# EAGLE schematic amp-LNA-TQP3M9036 (EAGLE 9.2.2)
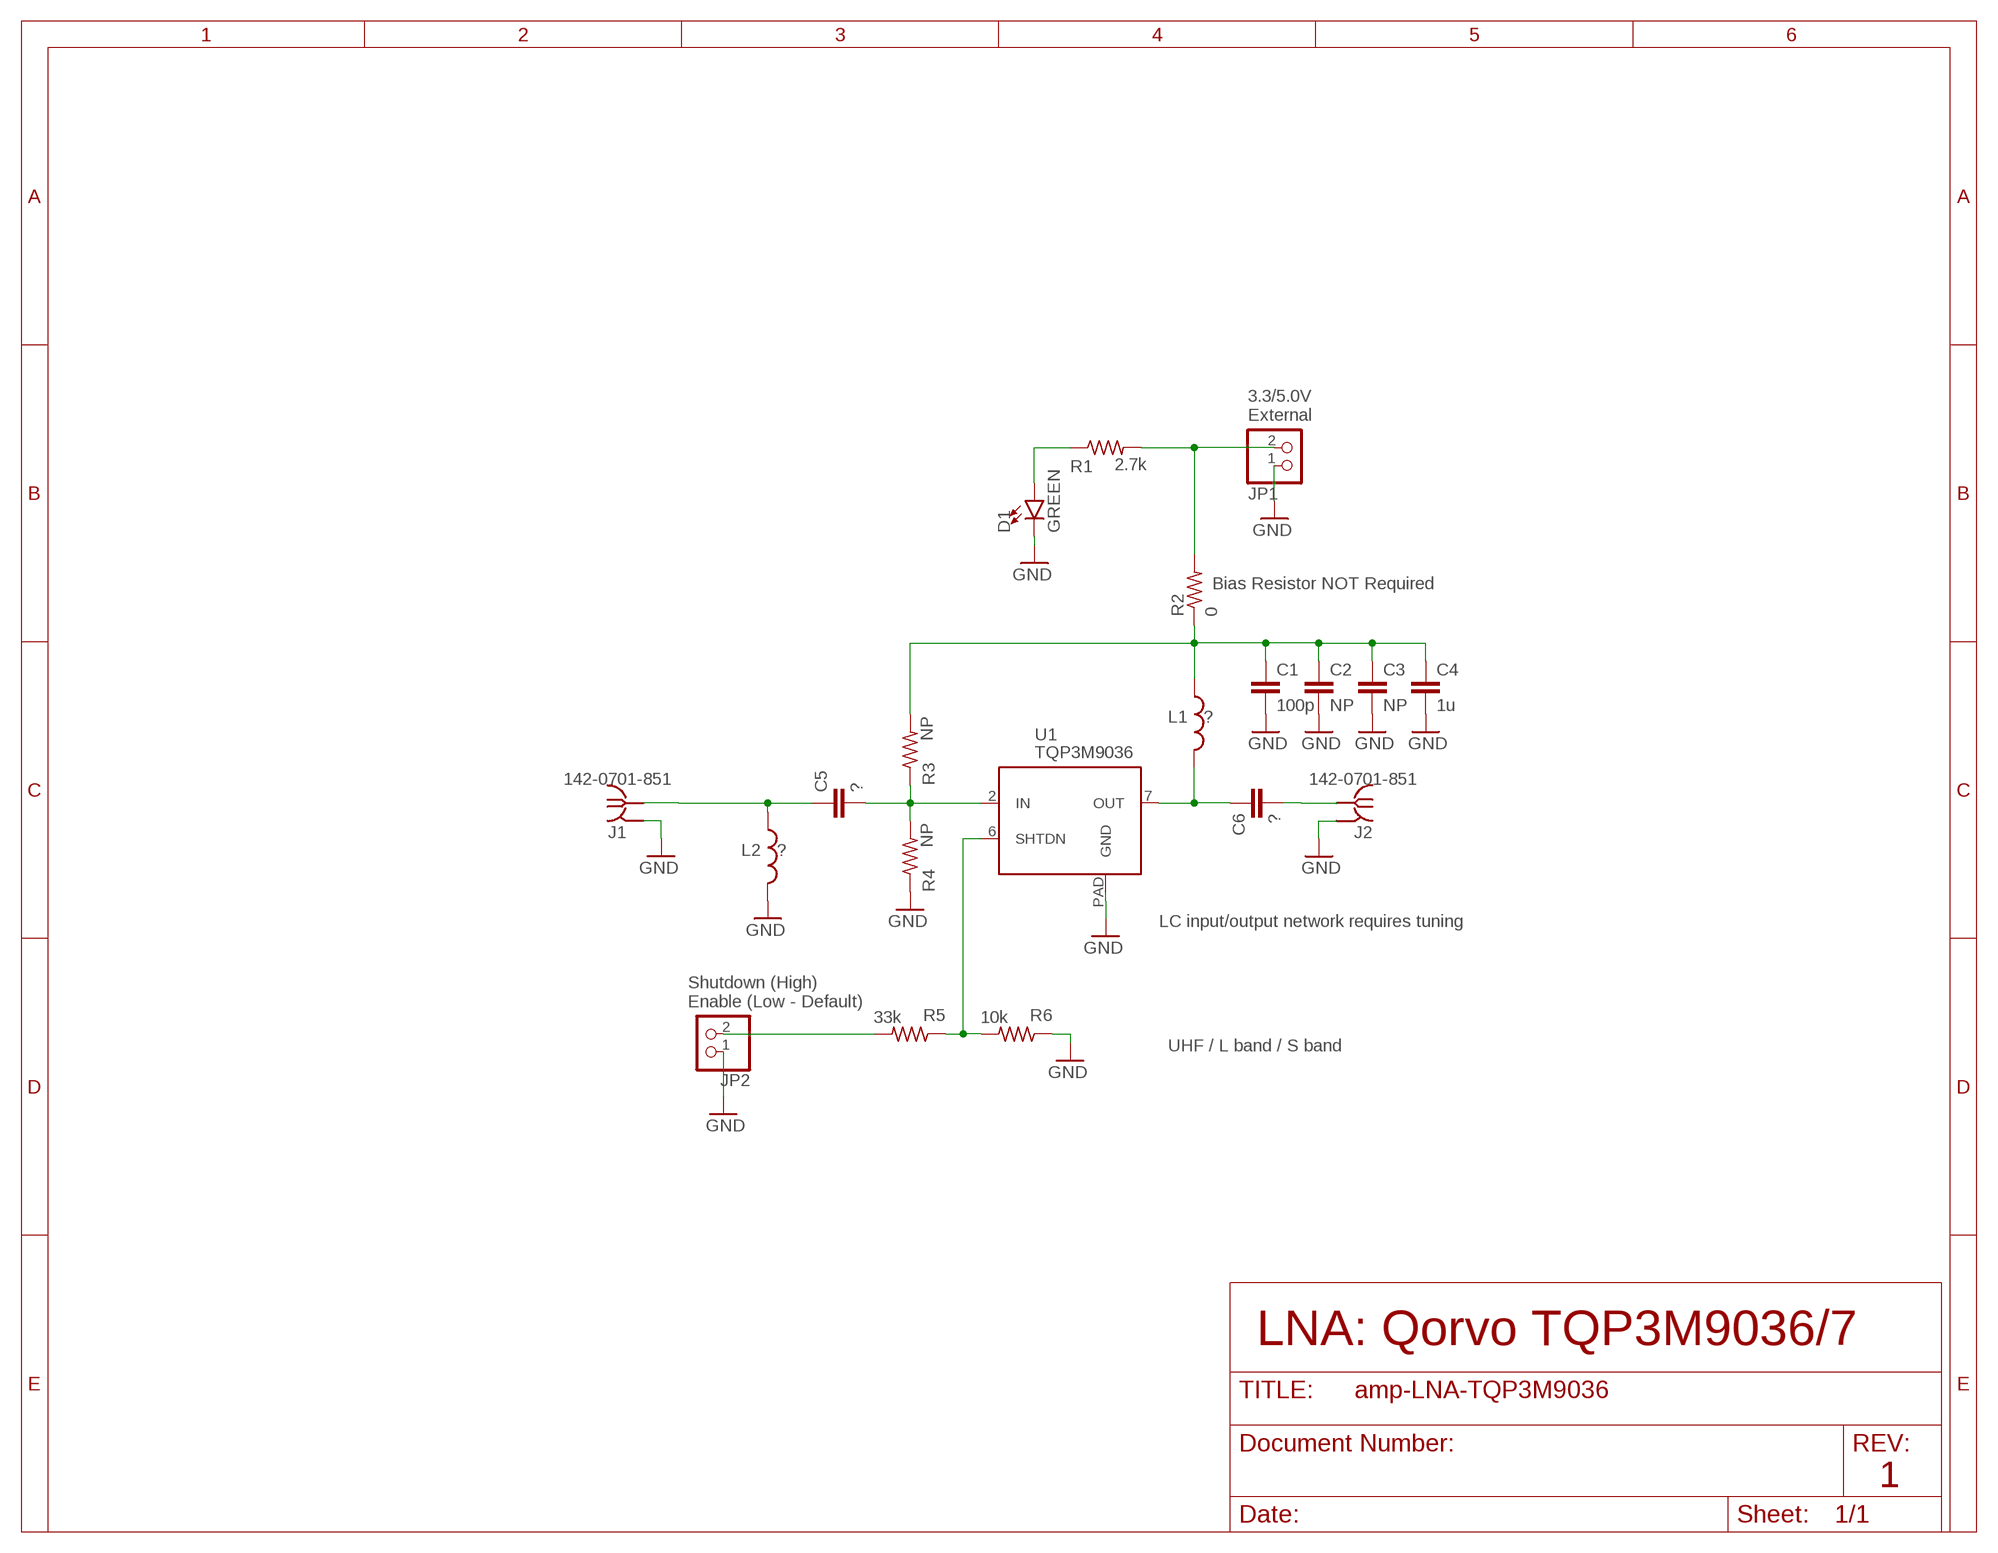
[diagram p0: schematic, sheet 1]

## Parts
C1  100p  C-EU0603-B-NOSILK  [.0603-B-NOSILK]
C2  NP  C-EU0603-B-NOSILK  [.0603-B-NOSILK]
C3  NP  C-EU0603-B-NOSILK  [.0603-B-NOSILK]
C4  1u  C-EU0603-B-NOSILK  [.0603-B-NOSILK]
C5  ?  C-EU0402-B-NOSILK  [.0402-B-NOSILK]
C6  ?  C-EU0402-B-NOSILK  [.0402-B-NOSILK]
D1  GREEN  LED-GREEN0603  [LED-0603]
J1  142-0701-851  [142-0701-851]
J2  142-0701-851  [142-0701-851]
JP1  PINHD-1X2  [1X02]
JP2  PINHD-1X2  [1X02]
L1  ?  L-US0603-B-NOSILK  [.0603-B-NOSILK]
L2  ?  L-US0402-B-NOSILK  [.0402-B-NOSILK]
R1  2.7k  R-US_0603-B-NOSILK  [.0603-B-NOSILK]
R2  0  R-US_0805-B-NOSILK  [.0805-B-NOSILK]
R3  NP  R-US_0402-B-NOSILK  [.0402-B-NOSILK]
R4  NP  R-US_0402-B-NOSILK  [.0402-B-NOSILK]
R5  33k  R-US_0603-B-NOSILK  [.0603-B-NOSILK]
R6  10k  R-US_0603-B-NOSILK  [.0603-B-NOSILK]
U1  TQP3M9036  [DFN8-2X2-WITH-PAD]

## Nets
GND: C1.2 C2.2 C3.2 C4.2 D1.C J1.GND1(GND) J1.GND2(GND) J1.GND3(GND) J1.GND4(GND) J2.GND1(GND) J2.GND2(GND) J2.GND3(GND) J2.GND4(GND) JP1.1 JP2.1 L2.2 R4.1 R6.1 U1.PAD(GND)
N$1: JP1.2 R1.2 R2.2
N$2: R5.1 R6.2 U1.6(SHTDN)
N$3: JP2.2 R5.2
N$21: D1.A R1.1
N$28: C6.1 L1.2 U1.7(OUT)
N$32: C5.2 R3.1 R4.2 U1.2(IN)
N$34: C6.2 J2.RF1(RF)
N$39: C5.1 J1.RF1(RF) L2.1
N$47: C1.1 C2.1 C3.1 C4.1 L1.1 R2.1 R3.2

## Notes on the sheet
- 3.3/5.0V
  External
- Bias Resistor NOT Required
- LC input/output network requires tuning
- Shutdown (High)
  Enable (Low - Default)
- UHF / L band / S band
- LNA: Qorvo TQP3M9036/7
- 1

## Library data of the parts
C1-C6 = oresat-rcl:C-EU: CAPACITOR, European symbol
D1 = SparkFun-LED:LED-GREEN: Green SMD LED Used in manufacturing of various products at SparkFun Packages: 0603 - SMD 0603 package [Product Link] <http://www.futureelectronics.com/en/technologies/semiconductors/optoelectronics/leds/Pages/9894312-LTST-C190GKT.aspx?CrossPart=HSMG-C190&IM=0> LilyPad 1206 - SMD1206 LilyPad package [Product Link] <http://www.futureelectronics.com/en/Technologies/Product.aspx?ProductID=IN150NGHARVATEKCORPORATION2049943&IM=0> 1206 - SMD1206 package [Product Link] <http://www.futureelectronics.com/en/technologies/semiconductors/optoelectronics/leds/Pages/8315665-LTST-C150KGKT.aspx?IM=0> 1206 Bottom Mount -SMD 1206 Bottom Mount [Product Link] <http://www.digikey.com/product-detail/en/lite-on-inc/LTST-C230KGKT/160-1456-1-ND/386854> SparkFun Products: Pro Mini 328 -5V <https://www.sparkfun.com/products/821> RedBoard <https://www.sparkfun.com/products/12757> MP3 Trigger <https://www.sparkfun.com/products/13720> Makey Makey <https://www.sparkfun.com/products/11076>
J1 J2 = J-Cinch-142-0701-851-SMA-end-launch:142-0701-851: SMA Jack 50Ω - End Launch Source: Datasheet <https://belfuse.com/resources/productinformations/cinchconnectivitysolutions/johnson/pi-ccs-john-142-0701-851.pdf>
JP1 JP2 = pinhead:PINHD-1X2: PIN HEADER
L1 L2 = oresat-rcl:L-US: INDUCTOR, American symbol
R1-R6 = oresat-rcl:R-US_: RESISTOR, American symbol
U1 = U-Qorvo-TQP3M9036-LNA:TQP3M9036: Ultra Low Noise, High Linearity LNA 0.1 - 2.0 GHz Operational Bandwidth Source: Datasheet <https://www.qorvo.com/products/p/TQP3M9036>